# EAGLE design joystickV1 (EAGLE 6.2)
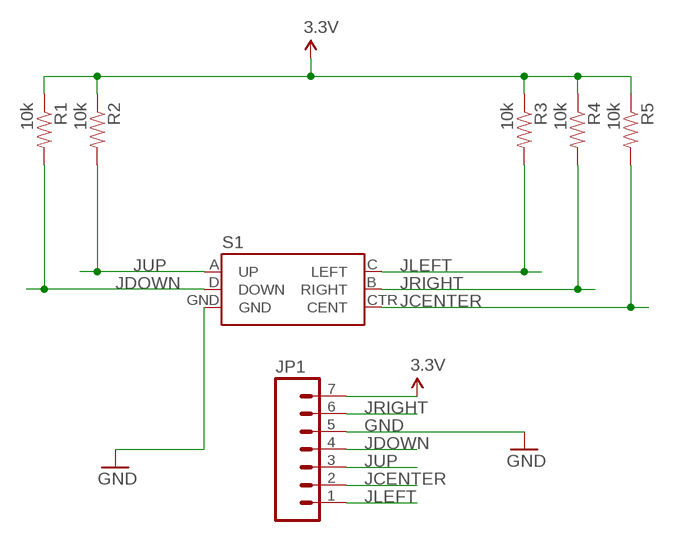
[diagram p0: schematic, sheet 1]

## Parts
JP1  M07  [1X07]
R1  10k  RESISTOR0603-RES  [0603-RES]
R2  10k  RESISTOR0603-RES  [0603-RES]
R3  10k  RESISTOR0603-RES  [0603-RES]
R4  10k  RESISTOR0603-RES  [0603-RES]
R5  10k  RESISTOR0603-RES  [0603-RES]
S1  JOYSTICK_MINI  [JOYSTICK_MINI]

## Nets
3.3V: JP1.7 R1.1 R2.1 R3.1 R4.1 R5.1
GND: JP1.5 S1.GND
JCENTER: JP1.2 R5.2 S1.CTR(CENT)
JDOWN: JP1.4 R1.2 S1.D(DOWN)
JLEFT: JP1.1 R3.2 S1.C(LEFT)
JRIGHT: JP1.6 R4.2 S1.B(RIGHT)
JUP: JP1.3 R2.2 S1.A(UP)

## Library data of the parts
JP1 = SparkFun-Connectors:M07: Header 7 Standard 7-pin 0.1" header. Use with straight break away headers (SKU : PRT-00116), right angle break away headers (PRT-00553), swiss pins (PRT-00743), machine pins (PRT-00117), and female headers (PRT-00115). NOTES ON THE VARIANTS LOCK and LOCK_LONGPADS... This footprint was designed to help hold the alignment of a through-hole component (i.e. 7-pin header) while soldering it into place. You may notice that each hole has been shifted either up or down by 0.005 of an inch from it's more standard position (which is usually a perfectly straight line). This slight alteration caused the pins (the squares in the middle) to touch the edges of the holes. Because they are alternating, it causes a "brace" to hold the header in place. 0.005 has proven to be the perfect amount of "off-center" position when using our standard breakaway headers. Although looks a little odd when you look at the bare footprint, once you have a header in there, the alteration is very hard to notice. Also, if you push a header all the way into place, it is covered up entirely on the bottom side. This idea of altering the position of holes to aid alignment will be further integrated into the Sparkfun Library for other footprints. It can help hold any component with 3 or more connection pins.
R1-R5 = SparkFun-Resistors:RESISTOR: Resistor Basic schematic elements and footprints for 0603, 1206, and PTH resistors.
S1 = SparkFun-Electromechanical:JOYSTICK_MINI: Small 5-way tactile joystick, COM-10063 4UCON SF303GJ26

## Board
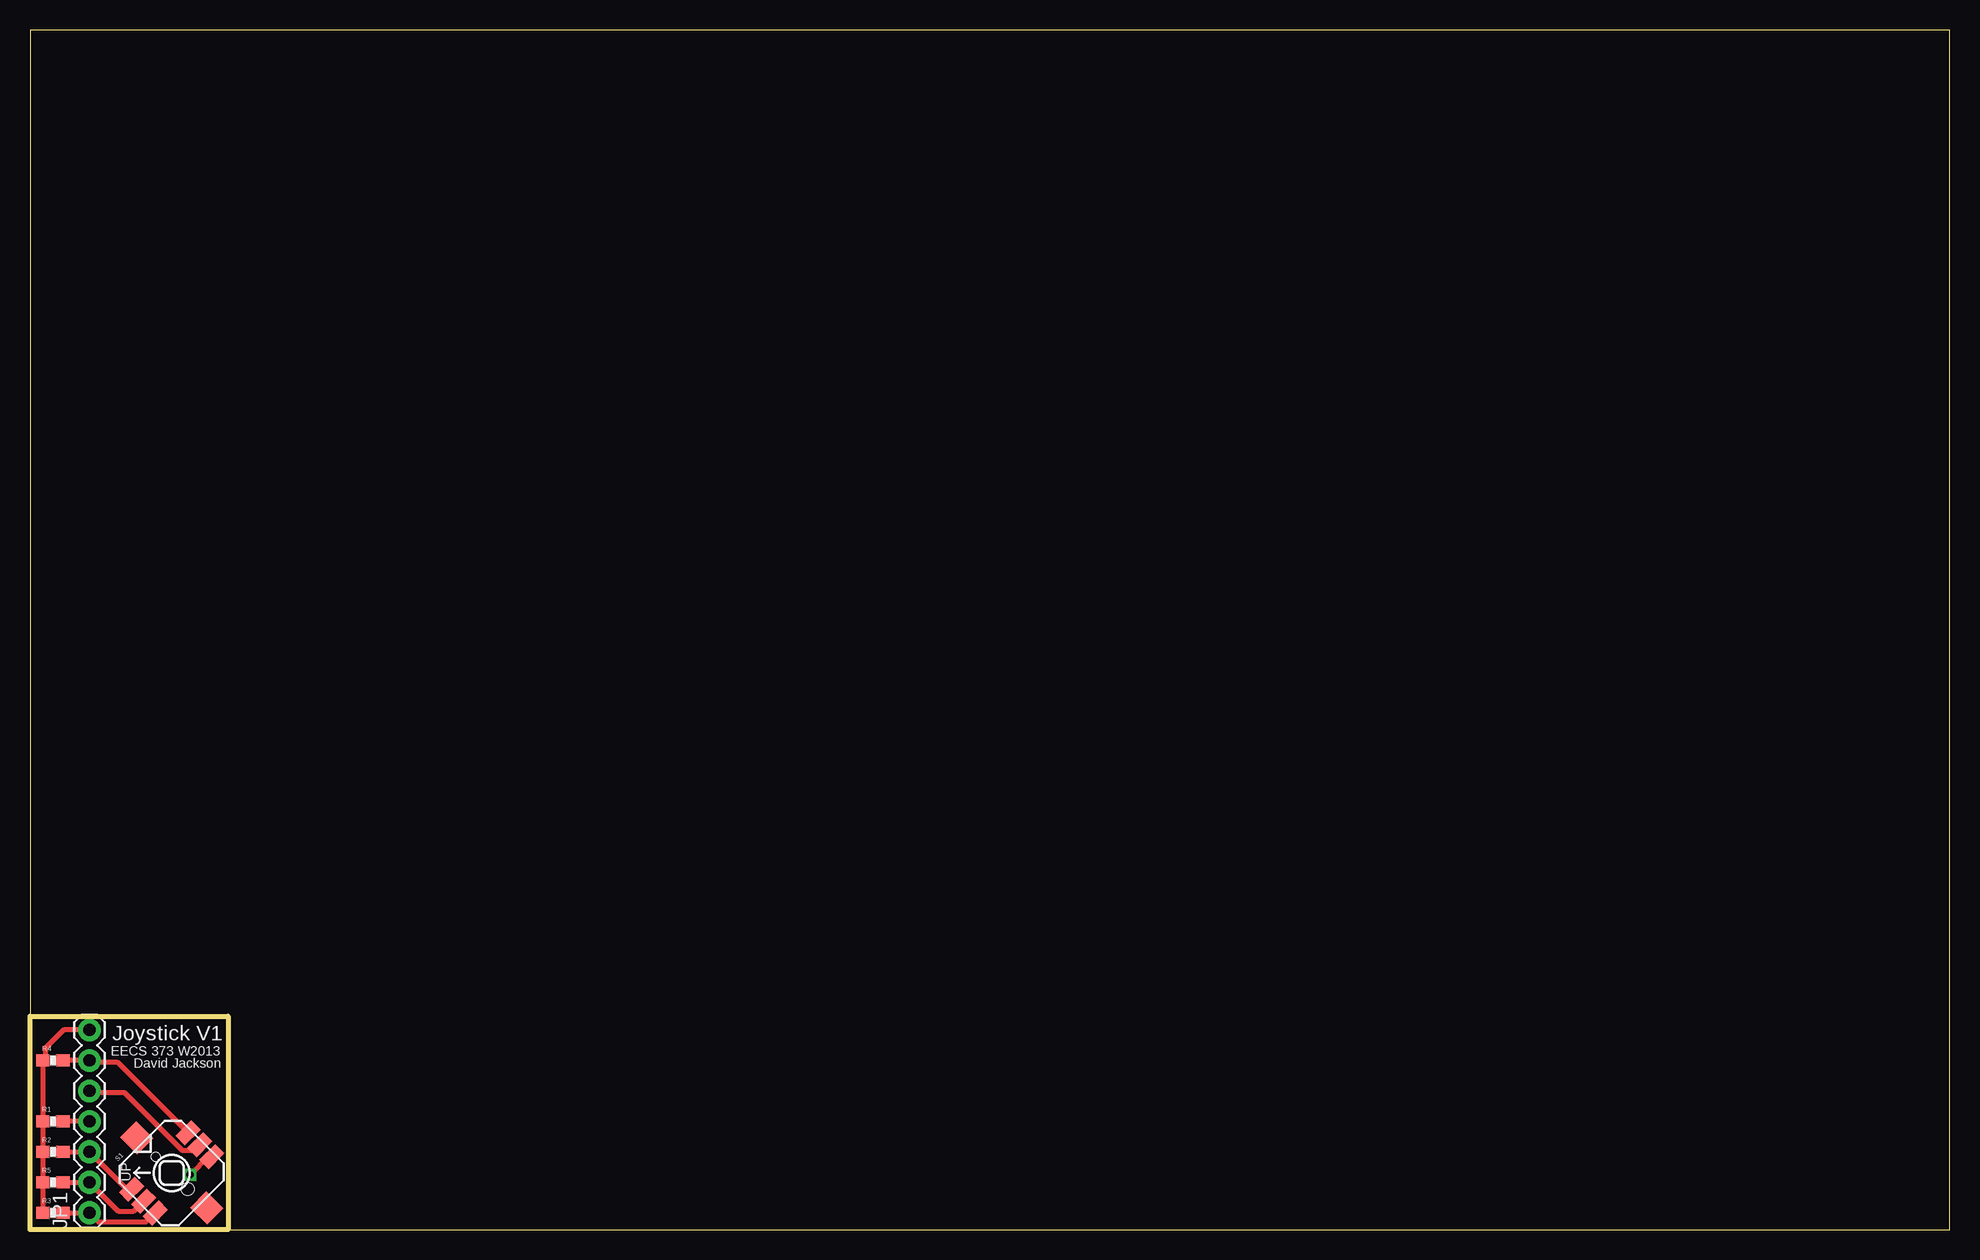
[diagram p1: board, top side]
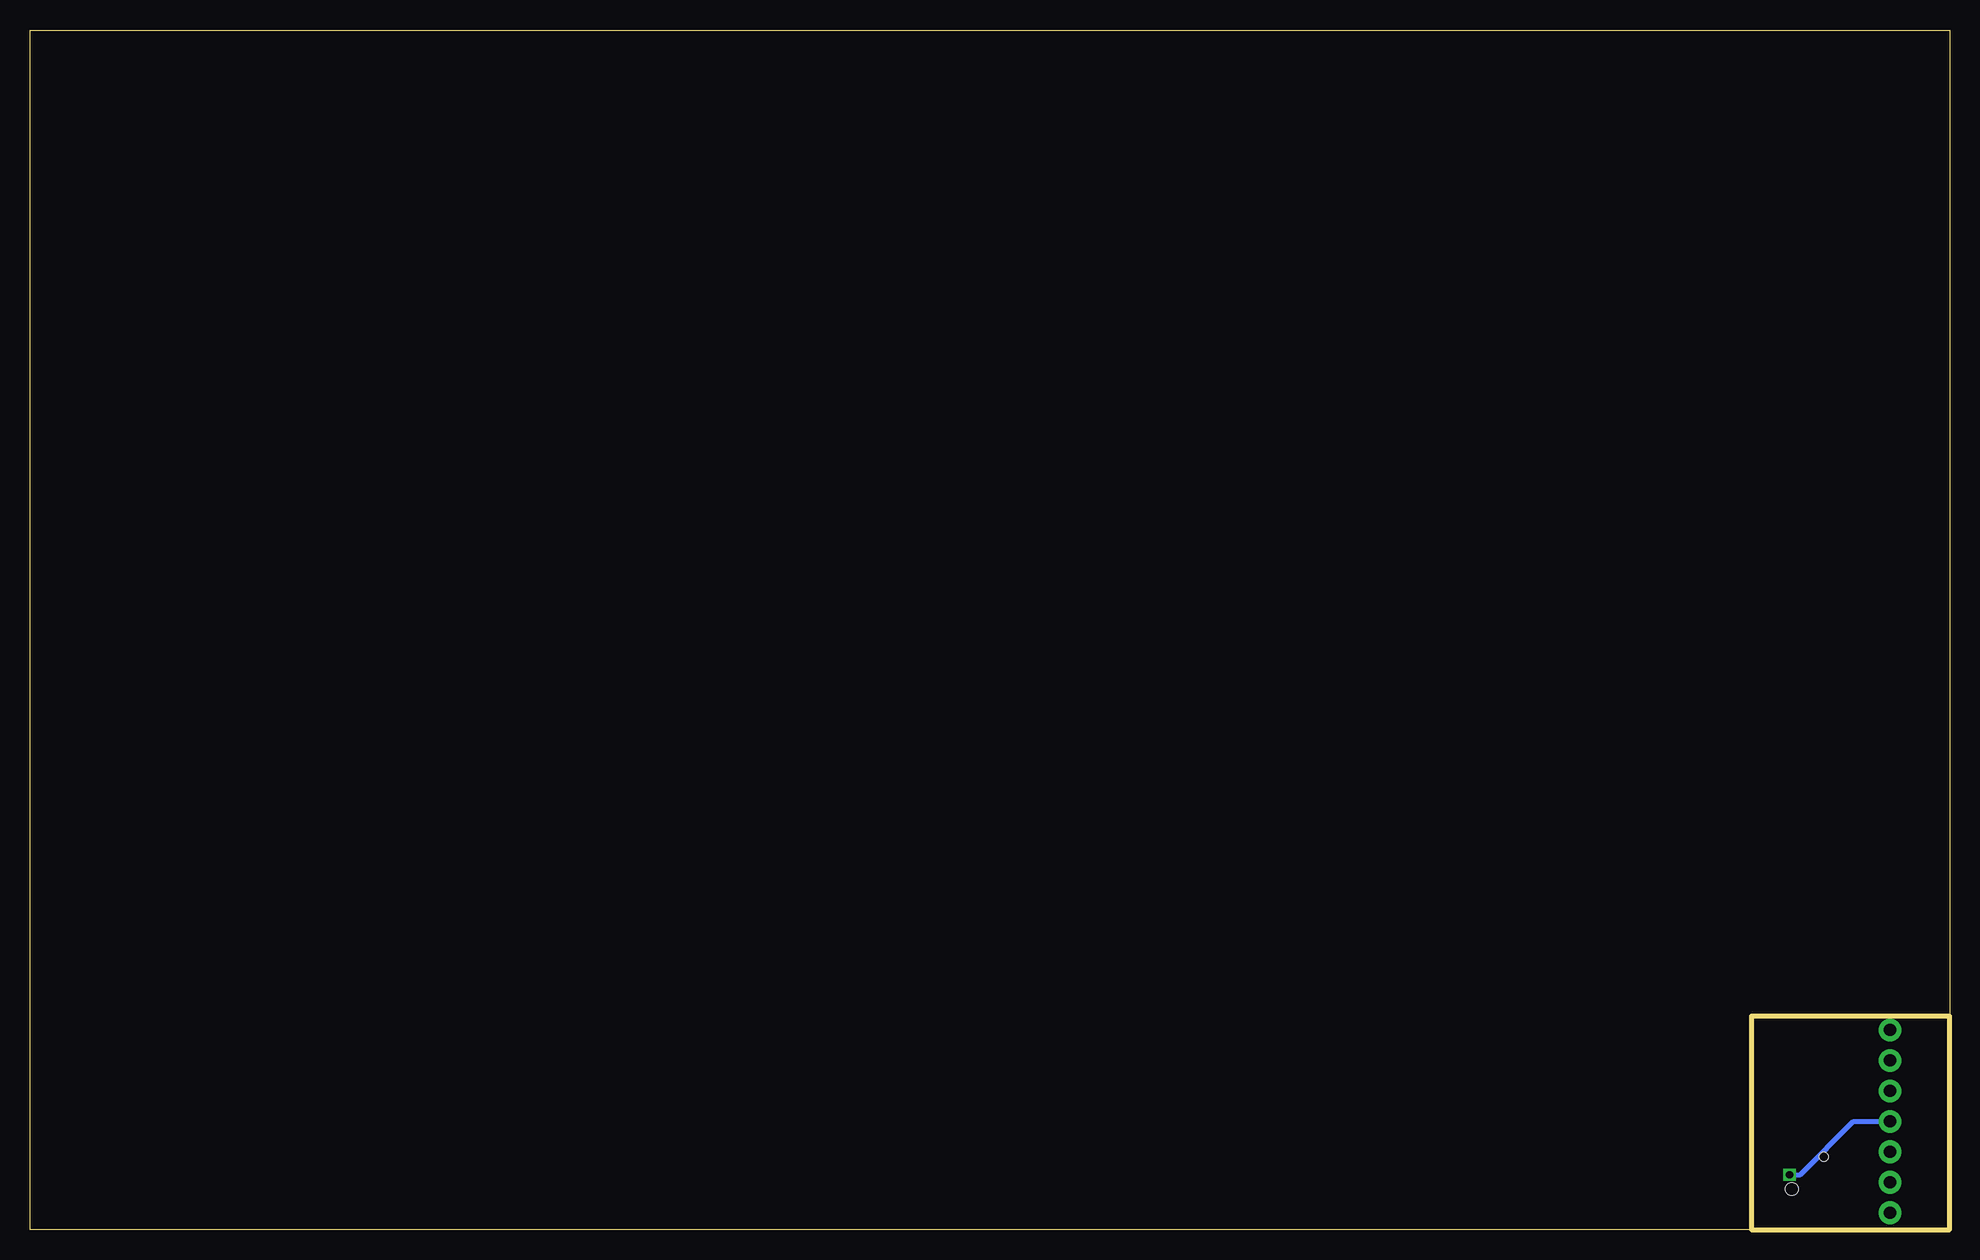
[diagram p2: board, bottom side, seen from below]

Size 160 x 100 mm. Coordinates in mm from the lower left corner, seen from the top.
Outline: 16.51,0 160,0 160,100 0,100 0,17.78
Outline: 0,17.78 0,0 16.51,0
Outline: 0,17.78 16.51,17.78 16.51,0
Copper layers (1*16): Top 0.035mm / dielectric 1.5mm / Bottom 0.035mm
Design rules: minimum track width 10mil, minimum drill 24mil, track to track 8mil, track to pad 8mil, pad to pad 8mil, via to via 8mil, smd to smd 8mil, copper to edge 40mil, drill to drill 8mil, minimum pad ring 10mil, minimum via ring 8mil, stop-mask expansion 4mil, vias tented up to drill 0mil, thermal gap 10mil

### Footprints (pad centres in the part's own frame; a part is rotated, then mirrored left to right if it is on the bottom)
1X07 = drill 1.016 pad 1.88: 1 0,0; 2 2.54,0; 3 5.08,0; 4 7.62,0; 5 10.16,0; 6 12.7,0; 7 15.24,0
0603-RES = smd 1.1 x 1: 1 -0.85,0; 2 0.85,0
JOYSTICK_MINI = smd 1.85 x 1.1: A -3.325,1.4; B 3.325,1.4; C -3.325,-1.4; CTR -3.325,0; D 3.325,-1.4; GND 3.325,0 | smd 1.9 x 2: NC 0,4.13; NC@0 0,-4.13 | hole 0.75: 0,1.9 | hole 1.05: 0,-1.9

### Placement (x,y rotation side)
JP1  4.95,1.4 90 top
R1  1.91,9.02 0 top
R2  1.91,6.48 0 top
R3  1.91,1.4 0 top
R4  1.91,14.1 0 top
R5  1.91,3.94 0 top
S1  11.81,4.72 45 top

### Tracks (layer width: path | path; a pad name or v marks a point on that pad's centre or on a via)
3.3V
  Top 0.406: JP1.7 2.79,16.64 1.27,15.11 1.27,14.31 R4.1 R1.1 R2.1 R5.1 R3.1
GND
  Top 0.406: JP1.5 4.95,11.43 7.87,11.43 12.7,6.6 13.7,6.6 S1.GND
JCENTER
  Top 0.406: R5.2 JP1.2 7.37,1.52 8.64,1.52 9.46,2.35 S1.CTR
JDOWN  (via drill 0.6)
  Top 0.406: S1.D 15.13,6.08 15.11,6.1 14.86,6.1 v13.34,4.57 | JP1.4 R1.2
  Bottom 0.406: v13.34,4.57 12.45,4.57 8,9.02 JP1.4
JLEFT
  Top 0.406: R3.2 JP1.1 5.71,0.64 9.65,0.64 10.39,1.38 S1.C
JRIGHT
  Top 0.406: R4.2 JP1.6 5.08,13.97 7.26,13.97 S1.B
JUP
  Top 0.406: R2.2 JP1.3 8.07,3.36 S1.A

### Text on the board
tNames: Joystick V1 | EECS 373 W2013 | David Jackson